# Altium project aes.PrjPcb
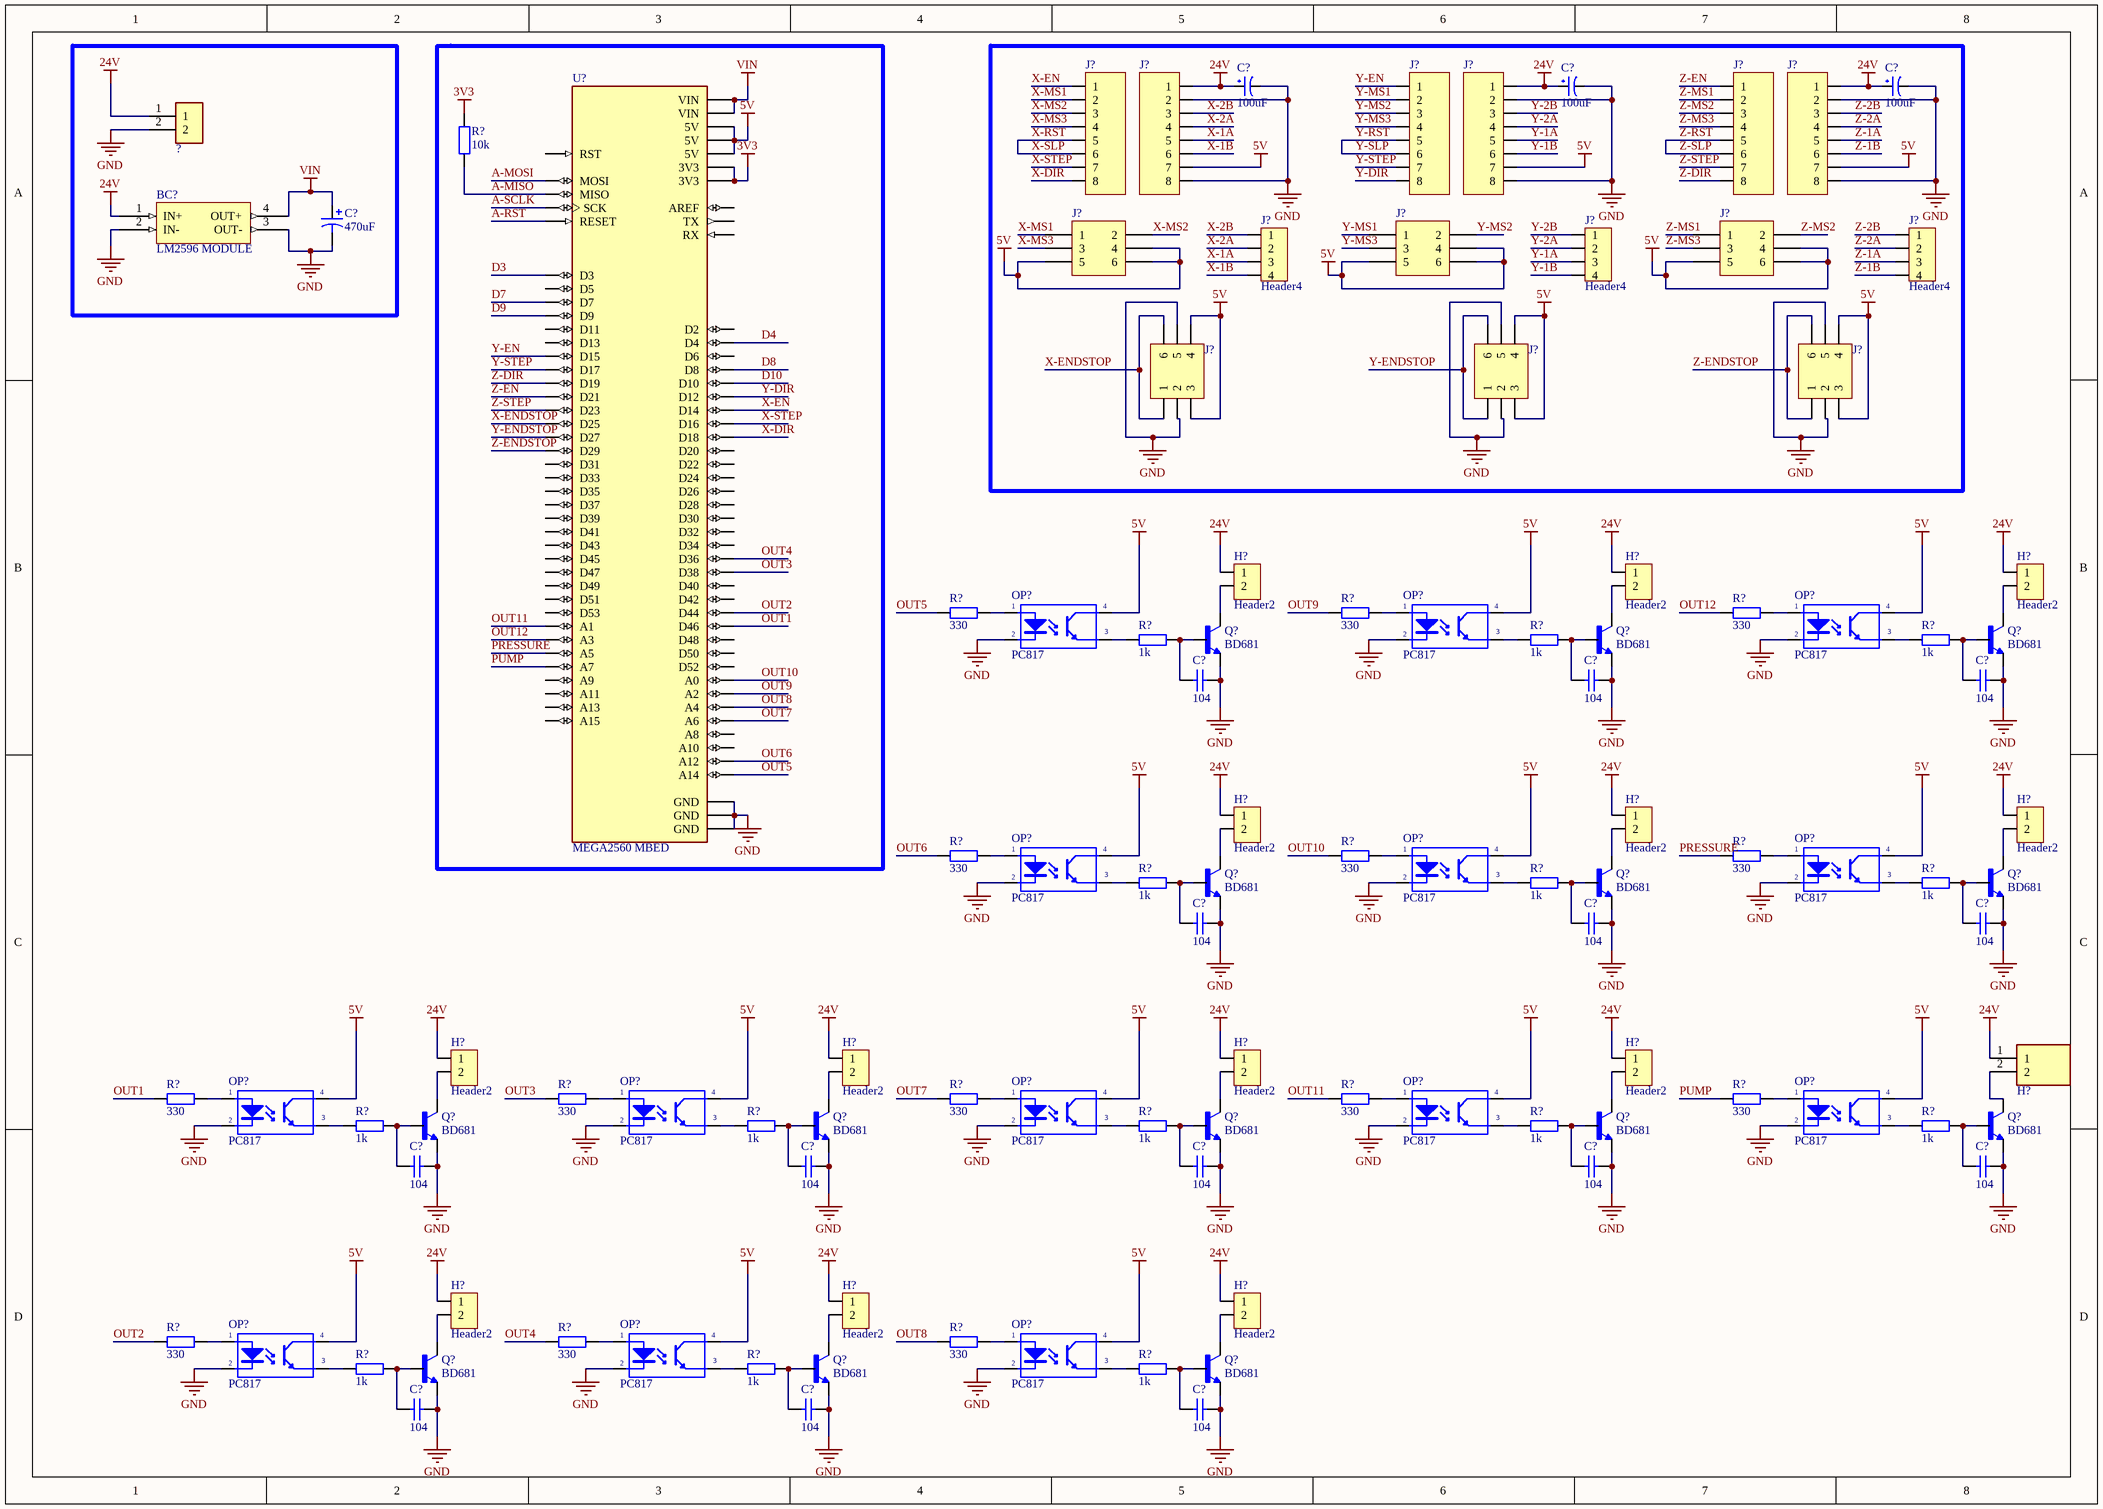
[diagram p0: aes_schematic.SchDoc]
1 sheet, 107 parts. Net scope: global (net labels, ports and power ports of the same name join across sheets).

## Sheet aes_schematic.SchDoc
size A3; Organization: Altium Limited; Address1: L3, 12a Rodborough Rd; Address2: Frenchs Forest; Address3: NSW; Address4: Australia 2086

### Parts
(Parts that share a designator on the sheet are numbered #1, #2 ... from top to bottom, then left to right.)
?  282837-2  [TE_1546833-2]  (value not drawn)
BC?  LM2596 MODULE  [BUCK_LM2596]
C?#1  100uF  [CAP 8x11.5x3.5mm RA]
C?#2  100uF  [CAP 8x11.5x3.5mm RA]
C?#3  100uF  [CAP 8x11.5x3.5mm RA]
C?#4  470uF  [TU HOA  450uF - 35V]
C?#5  value 104  [Tu-pico]  (hidden comment: Capacitor Ceramic)
C?#6  value 104  [Tu-pico]  (hidden comment: Capacitor Ceramic)
C?#7  value 104  [Tu-pico]  (hidden comment: Capacitor Ceramic)
C?#8  value 104  [Tu-pico]  (hidden comment: Capacitor Ceramic)
C?#9  value 104  [Tu-pico]  (hidden comment: Capacitor Ceramic)
C?#10  value 104  [Tu-pico]  (hidden comment: Capacitor Ceramic)
C?#11  value 104  [Tu-pico]  (hidden comment: Capacitor Ceramic)
C?#12  value 104  [Tu-pico]  (hidden comment: Capacitor Ceramic)
C?#13  value 104  [Tu-pico]  (hidden comment: Capacitor Ceramic)
C?#14  value 104  [Tu-pico]  (hidden comment: Capacitor Ceramic)
C?#15  value 104  [Tu-pico]  (hidden comment: Capacitor Ceramic)
C?#16  value 104  [Tu-pico]  (hidden comment: Capacitor Ceramic)
C?#17  value 104  [Tu-pico]  (hidden comment: Capacitor Ceramic)
C?#18  value 104  [Tu-pico]  (hidden comment: Capacitor Ceramic)
H?#1  Header2  [Header2]
H?#2  Header2  [Header2]
H?#3  Header2  [Header2]
H?#4  Header2  [Header2]
H?#5  Header2  [Header2]
H?#6  Header2  [Header2]
H?#7  Header2  [Header2]
H?#8  Header2  [Header2]
H?#9  Header2  [Header2]
H?#10  Header2  [Header2]
H?#11  647676-2  [HED2B]  (value not drawn)
H?#12  Header2  [Header2]
H?#13  Header2  [Header2]
H?#14  Header2  [Header2]
J?#1  JP8  [JP8-C1T]  (value not drawn)
J?#2  JP8  [JP8-C1T]  (value not drawn)
J?#3  JP8  [JP8-C1T]  (value not drawn)
J?#4  JP8  [JP8-C1T]  (value not drawn)
J?#5  JP8  [JP8-C1T]  (value not drawn)
J?#6  JP8  [JP8-C1T]  (value not drawn)
J?#7  Header 3X2  [JP3x2]  (value not drawn)
J?#8  Header 3X2  [JP3x2]  (value not drawn)
J?#9  Header 3X2  [JP3x2]  (value not drawn)
J?#10  Header4  [Header4]
J?#11  Header4  [Header4]
J?#12  Header4  [Header4]
J?#13  JP3x2  [JP3-D2T]  (value not drawn)
J?#14  JP3x2  [JP3-D2T]  (value not drawn)
J?#15  JP3x2  [JP3-D2T]  (value not drawn)
OP?#1  PC817  [DIP4/W0.3]
OP?#2  PC817  [DIP4/W0.3]
OP?#3  PC817  [DIP4/W0.3]
OP?#4  PC817  [DIP4/W0.3]
OP?#5  PC817  [DIP4/W0.3]
OP?#6  PC817  [DIP4/W0.3]
OP?#7  PC817  [DIP4/W0.3]
OP?#8  PC817  [DIP4/W0.3]
OP?#9  PC817  [DIP4/W0.3]
OP?#10  PC817  [DIP4/W0.3]
OP?#11  PC817  [DIP4/W0.3]
OP?#12  PC817  [DIP4/W0.3]
OP?#13  PC817  [DIP4/W0.3]
OP?#14  PC817  [DIP4/W0.3]
Q?#1  BD681  [TO229P780X300X2000-3]
Q?#2  BD681  [TO229P780X300X2000-3]
Q?#3  BD681  [TO229P780X300X2000-3]
Q?#4  BD681  [TO229P780X300X2000-3]
Q?#5  BD681  [TO229P780X300X2000-3]
Q?#6  BD681  [TO229P780X300X2000-3]
Q?#7  BD681  [TO229P780X300X2000-3]
Q?#8  BD681  [TO229P780X300X2000-3]
Q?#9  BD681  [TO229P780X300X2000-3]
Q?#10  BD681  [TO229P780X300X2000-3]
Q?#11  BD681  [TO229P780X300X2000-3]
Q?#12  BD681  [TO229P780X300X2000-3]
Q?#13  BD681  [TO229P780X300X2000-3]
Q?#14  BD681  [TO229P780X300X2000-3]
R?#1  10k  [R1/4W]
R?#2  330  [R1/4W]
R?#3  330  [R1/4W]
R?#4  330  [R1/4W]
R?#5  1k  [R1/4W]
R?#6  1k  [R1/4W]
R?#7  1k  [R1/4W]
R?#8  330  [R1/4W]
R?#9  330  [R1/4W]
R?#10  330  [R1/4W]
R?#11  1k  [R1/4W]
R?#12  1k  [R1/4W]
R?#13  1k  [R1/4W]
R?#14  330  [R1/4W]
R?#15  330  [R1/4W]
R?#16  330  [R1/4W]
R?#17  330  [R1/4W]
R?#18  330  [R1/4W]
R?#19  1k  [R1/4W]
R?#20  1k  [R1/4W]
R?#21  1k  [R1/4W]
R?#22  1k  [R1/4W]
R?#23  1k  [R1/4W]
R?#24  330  [R1/4W]
R?#25  330  [R1/4W]
R?#26  330  [R1/4W]
R?#27  1k  [R1/4W]
R?#28  1k  [R1/4W]
R?#29  1k  [R1/4W]
U?  MEGA2560 MBED  [MODULE_MEGA_PRO_EMBED_CH340G_/_ATMEGA2560]

### Nets
3V3: R?#1.2 U?.3V3_1(3V3) U?.3V3_2(3V3)
5V: J?#2.7 J?#4.7 J?#6.7 J?#7.4 J?#7.5 J?#7.6 J?#8.4 J?#8.5 J?#8.6 J?#9.4 J?#9.5 J?#9.6 J?#13.3 J?#13.4 J?#14.3 J?#14.4 J?#15.3 J?#15.4 OP?#1.4(C) OP?#2.4(C) OP?#3.4(C) OP?#4.4(C) OP?#5.4(C) OP?#6.4(C) OP?#7.4(C) OP?#8.4(C) OP?#9.4(C) OP?#10.4(C) OP?#11.4(C) OP?#12.4(C) OP?#13.4(C) OP?#14.4(C) U?.5V_1(5V) U?.5V_2(5V) U?.5V_3(5V)
24V: ?.1 BC?.1(IN+) C?#1.1 C?#2.1 C?#3.1 H?#1.1 H?#2.1 H?#3.1 H?#4.1 H?#5.1 H?#6.1 H?#7.1 H?#8.1 H?#9.1 H?#10.1 H?#11.1 H?#12.1 H?#13.1 H?#14.1 J?#2.1 J?#4.1 J?#6.1
GND: ?.2 BC?.2(IN-) BC?.3(OUT-) C?#1.2 C?#2.2 C?#3.2 C?#4.2 C?#5.1 C?#6.1 C?#7.1 C?#8.1 C?#9.1 C?#10.1 C?#11.1 C?#12.1 C?#13.1 C?#14.1 C?#15.1 C?#16.1 C?#17.1 C?#18.1 J?#2.2 J?#2.8 J?#4.2 J?#4.8 J?#6.2 J?#6.8 J?#13.2 J?#13.5 J?#14.2 J?#14.5 J?#15.2 J?#15.5 OP?#1.2(K) OP?#2.2(K) OP?#3.2(K) OP?#4.2(K) OP?#5.2(K) OP?#6.2(K) OP?#7.2(K) OP?#8.2(K) OP?#9.2(K) OP?#10.2(K) OP?#11.2(K) OP?#12.2(K) OP?#13.2(K) OP?#14.2(K) Q?#1.1(E) Q?#2.1(E) Q?#3.1(E) Q?#4.1(E) Q?#5.1(E) Q?#6.1(E) Q?#7.1(E) Q?#8.1(E) Q?#9.1(E) Q?#10.1(E) Q?#11.1(E) Q?#12.1(E) Q?#13.1(E) Q?#14.1(E) U?.GND_1(GND) U?.GND_2(GND) U?.GND_3(GND)
VIN: BC?.4(OUT+) C?#4.1 U?.VIN_1(VIN) U?.VIN_2(VIN)
A-MISO: R?#1.1 U?.MISO
A-MOSI: U?.MOSI
A-RST: U?.RESET
A-SCLK: U?.SCK
D3: U?.D3
D4: U?.D4
D7: U?.D7
D8: U?.D8
D9: U?.D9
D10: U?.D10
OUT1: R?#14.2 U?.D46
OUT2: R?#24.2 U?.D44
OUT3: R?#15.2 U?.D38
OUT4: R?#25.2 U?.D36
OUT5: R?#2.2 U?.A14
OUT6: R?#8.2 U?.A12
OUT7: R?#16.2 U?.A6
OUT8: R?#26.2 U?.A4
OUT9: R?#3.2 U?.A2
OUT10: R?#9.2 U?.A0
OUT11: R?#17.2 U?.A1
OUT12: R?#4.2 U?.A3
PRESSURE: R?#10.2 U?.A5
PUMP: R?#18.2 U?.A7
X-1A: J?#2.5 J?#10.3
X-1B: J?#2.6 J?#10.4
X-2A: J?#2.4 J?#10.2
X-2B: J?#2.3 J?#10.1
X-DIR: J?#1.8 U?.D18
X-EN: J?#1.1 U?.D14
X-ENDSTOP: J?#13.1 J?#13.6 U?.D25
X-MS1: J?#1.2 J?#7.1
X-MS2: J?#1.3 J?#7.2
X-MS3: J?#1.4 J?#7.3
X-RST: J?#1.5 J?#1.6  [also labelled X-SLP]
X-STEP: J?#1.7 U?.D16
Y-1A: J?#4.5 J?#11.3
Y-1B: J?#4.6 J?#11.4
Y-2A: J?#4.4 J?#11.2
Y-2B: J?#4.3 J?#11.1
Y-DIR: J?#3.8 U?.D12
Y-EN: J?#3.1 U?.D15
Y-ENDSTOP: J?#14.1 J?#14.6 U?.D27
Y-MS1: J?#3.2 J?#8.1
Y-MS2: J?#3.3 J?#8.2
Y-MS3: J?#3.4 J?#8.3
Y-RST: J?#3.5 J?#3.6  [also labelled Y-SLP]
Y-STEP: J?#3.7 U?.D17
Z-1A: J?#6.5 J?#12.3
Z-1B: J?#6.6 J?#12.4
Z-2A: J?#6.4 J?#12.2
Z-2B: J?#6.3 J?#12.1
Z-DIR: J?#5.8 U?.D19
Z-EN: J?#5.1 U?.D21
Z-ENDSTOP: J?#15.1 J?#15.6 U?.D29
Z-MS1: J?#5.2 J?#9.1
Z-MS2: J?#5.3 J?#9.2
Z-MS3: J?#5.4 J?#9.3
Z-RST: J?#5.5 J?#5.6  [also labelled Z-SLP]
Z-STEP: J?#5.7 U?.D23
NetC?#5_2: C?#5.2 Q?#1.3(B) R?#5.1
NetC?#6_2: C?#6.2 Q?#2.3(B) R?#6.1
NetC?#7_2: C?#7.2 Q?#3.3(B) R?#7.1
NetC?#8_2: C?#8.2 Q?#4.3(B) R?#11.1
NetC?#9_2: C?#9.2 Q?#5.3(B) R?#12.1
NetC?#10_2: C?#10.2 Q?#6.3(B) R?#13.1
NetC?#11_2: C?#11.2 Q?#7.3(B) R?#19.1
NetC?#12_2: C?#12.2 Q?#8.3(B) R?#20.1
NetC?#13_2: C?#13.2 Q?#9.3(B) R?#21.1
NetC?#14_2: C?#14.2 Q?#10.3(B) R?#22.1
NetC?#15_2: C?#15.2 Q?#11.3(B) R?#23.1
NetC?#16_2: C?#16.2 Q?#12.3(B) R?#27.1
NetC?#17_2: C?#17.2 Q?#13.3(B) R?#28.1
NetC?#18_2: C?#18.2 Q?#14.3(B) R?#29.1
NetH?#1_2: H?#1.2 Q?#1.2(C)
NetH?#2_2: H?#2.2 Q?#2.2(C)
NetH?#3_2: H?#3.2 Q?#3.2(C)
NetH?#4_2: H?#4.2 Q?#4.2(C)
NetH?#5_2: H?#5.2 Q?#5.2(C)
NetH?#6_2: H?#6.2 Q?#6.2(C)
NetH?#7_2: H?#7.2 Q?#7.2(C)
NetH?#8_2: H?#8.2 Q?#8.2(C)
NetH?#9_2: H?#9.2 Q?#9.2(C)
NetH?#10_2: H?#10.2 Q?#10.2(C)
NetH?#11_2: H?#11.2 Q?#11.2(C)
NetH?#12_2: H?#12.2 Q?#12.2(C)
NetH?#13_2: H?#13.2 Q?#13.2(C)
NetH?#14_2: H?#14.2 Q?#14.2(C)
NetOP?#1_1: OP?#1.1(A) R?#2.1
NetOP?#1_3: OP?#1.3(E) R?#5.2
NetOP?#2_1: OP?#2.1(A) R?#3.1
NetOP?#2_3: OP?#2.3(E) R?#6.2
NetOP?#3_1: OP?#3.1(A) R?#4.1
NetOP?#3_3: OP?#3.3(E) R?#7.2
NetOP?#4_1: OP?#4.1(A) R?#8.1
NetOP?#4_3: OP?#4.3(E) R?#11.2
NetOP?#5_1: OP?#5.1(A) R?#9.1
NetOP?#5_3: OP?#5.3(E) R?#12.2
NetOP?#6_1: OP?#6.1(A) R?#10.1
NetOP?#6_3: OP?#6.3(E) R?#13.2
NetOP?#7_1: OP?#7.1(A) R?#14.1
NetOP?#7_3: OP?#7.3(E) R?#19.2
NetOP?#8_1: OP?#8.1(A) R?#15.1
NetOP?#8_3: OP?#8.3(E) R?#20.2
NetOP?#9_1: OP?#9.1(A) R?#16.1
NetOP?#9_3: OP?#9.3(E) R?#21.2
NetOP?#10_1: OP?#10.1(A) R?#17.1
NetOP?#10_3: OP?#10.3(E) R?#22.2
NetOP?#11_1: OP?#11.1(A) R?#18.1
NetOP?#11_3: OP?#11.3(E) R?#23.2
NetOP?#12_1: OP?#12.1(A) R?#24.1
NetOP?#12_3: OP?#12.3(E) R?#27.2
NetOP?#13_1: OP?#13.1(A) R?#25.1
NetOP?#13_3: OP?#13.3(E) R?#28.2
NetOP?#14_1: OP?#14.1(A) R?#26.1
NetOP?#14_3: OP?#14.3(E) R?#29.2

Not connected (* = marked no-connect by the designer): U? A8 A9 A10 A11 A13 A15 AREF D2 D5 D6 D11 D13 D20 D22 D24 D26 D28 D30 D31 D32 D33 D34 D35 D37 D39 D40 D41 D42 D43 D45 D47 D48 D49 D50 D51 D52 D53 RST RX TX

### Notes on the sheet
- Title
- Size:
- Date:
- File:
- A2
- Number:
- Time:
- Revision:
- Sheet
- of

### Library data of the parts
? = Header_Screw_2P: Connector Terminal Blocks Receptacle 2 Position 5.08mm Solder Straight Thru-Hole 13.5A/Contact; MF: TE Connectivity; Price: None; Check_prices: https://www.snapeda.com/parts/282837-2/TE%20Connectivity%20AMP%20Connectors/view-part/2549980/?ref=eda; Package: None; Purchase-URL: https://pricing.snapeda.com/search/part/282837-2/?ref=eda; SnapEDA_Link: https://www.snapeda.com/parts/282837-2/TE%20Connectivity%20AMP%20Connectors/view-part/2549980/?ref=snap; Value: *; MP: 282837-2; Availability: Good
C?#1-C?#3 = Cap_Polar
C?#4 = Cap Pol 8mm: Polarized Capacitor (Axial); Published: 8-Jun-2000; LatestRevisionDate: 17-Jul-2002; LatestRevisionNote: Re-released for DXP Platform.; PackageReference: POLAR0.8; Publisher: Altium Limited
C?#5-C?#18 = CapCeramic: Capacitor; Published: 8-Jun-2000; LatestRevisionDate: 17-Jul-2002; LatestRevisionNote: Re-released for DXP Platform.; PackageReference: RAD-0.3; Publisher: Altium Limited
H?#1-H?#10 H?#12-H?#14 = Header2: Header IDC, 2 x 1 Pin Vertical 2.54mm Pitch (Non-Boxed, Male); Manufacturer: W¨¹rth Elektronik eiSos GmbH; partNo: 613002143121; ComponentLink1 Description: Manufacturer; ComponentLink2 Description: Datasheet; NoPins: 02; Created Date: 29 March 2013; ComponentLink1URL: http://www.we-online.com; ComponentLink2URL: http://katalog.we-online.de/em/datasheet/6130xx143121.pdf; Created by: Karrer Zheng
H?#11 = Header_2P: Number_of_Positions: 2; MF: TE Connectivity; Centerline_Pitch: 3.96 mm[.156 in]; Product_Type: Header; SnapEDA_Link: https://www.snapeda.com/parts/647676-2/TE%20Connectivity%20AMP%20Connectors/view-part/2371252/?ref=snap; Price: None; EU_RoHS_Compliance: Compliant; MP: 647676-2; Value: *; Availability: Unavailable; TE_purchase_URL: https://www.te.com/usa-en/product-647676-2.html?te_bu=Cor&te_type=disp&te_campaign=seda_glo_cor-seda-global-disp-prtnr-fy19-seda-model-bom-cta_sma-317_1&elqCampaignId=32493; Package: None
J?#1-J?#6 = JP8: WR-PHD 2.54 mm Angled Socket Header; Manufacturer: W¨¹rth Elektronik eiSos GmbH; partNo: 613008143121; ComponentLink1 Description: Manufacturer; ComponentLink2 Description: Datasheet; NoPins: 08; Created Date: 29 March 2013; ComponentLink1URL: http://www.we-online.com; ComponentLink2URL: http://katalog.we-online.de/em/datasheet/6130xx143121.pdf; Created by: Karrer Zheng
J?#7-J?#9 = Header 3X2: Header, 3-Pin, Dual row; LatestRevisionDate: 17-Jul-2002; LatestRevisionNote: Re-released for DXP Platform.; Publisher: Altium Limited
J?#10-J?#12 = Header4: Header IDC, 4 x 1 Pin Vertical 2.54mm Pitch (Non-Boxed, Male); Manufacturer: W¨¹rth Elektronik eiSos GmbH; partNo: 613002143121; ComponentLink1 Description: Manufacturer; ComponentLink2 Description: Datasheet; NoPins: 02; Created Date: 29 March 2013; ComponentLink1URL: http://www.we-online.com; ComponentLink2URL: http://katalog.we-online.de/em/datasheet/6130xx143121.pdf; Created by: Karrer Zheng
J?#13-J?#15 = JP3x2: WR-PHD 2.54 mm Dual Socket Header; Manufacturer: W¨¹rth Elektronik eiSos GmbH; partNo: 61300621821; ComponentLink1 Description: Manufacturer; ComponentLink2 Description: Datasheet; NoPins: 06; Created Date: 29 March 2013; ComponentLink1URL: http://www.we-online.com; ComponentLink2URL: http://katalog.we-online.de/em/datasheet/6130xx21821.pdf; Created by: Karrer Zheng
OP?#1-OP?#14 = PC817: Single Opto; Value: PC817
Q?#1-Q?#14 = BD681: Bipolar _BJT_ Transistor NPN 45V 1.5A 1.25W Through Hole TO-225AA; MP: BD135; MF: ON Semiconductor; Package: TO-126-3 NXP Semiconductors; Availability: Unavailable; Value: *; SnapEDA_Link: https://www.snapeda.com/parts/BD135/ON%20Semiconductor/view-part/580489/?ref=snap; Price: None
R?#1-R?#29 = R1/4W: Resistor 1/4W; Value: R1/4W - 1K
U? = MEGA_PRO_EMBED_CH340G_/_ATMEGA2560: Mega 2560 PRO (Embed) CH340G/ATmega2560-16AU; MP: Mega Pro Embed CH340G / ATmega2560; MF: Robotdyn; Package: Package; Price: None; Availability: Unavailable; Value: *; SnapEDA_Link: https://www.snapeda.com/parts/Mega%20Pro%20Embed%20CH340G%20/%20ATmega2560/Robotdyn/view-part/4052597/?ref=snap